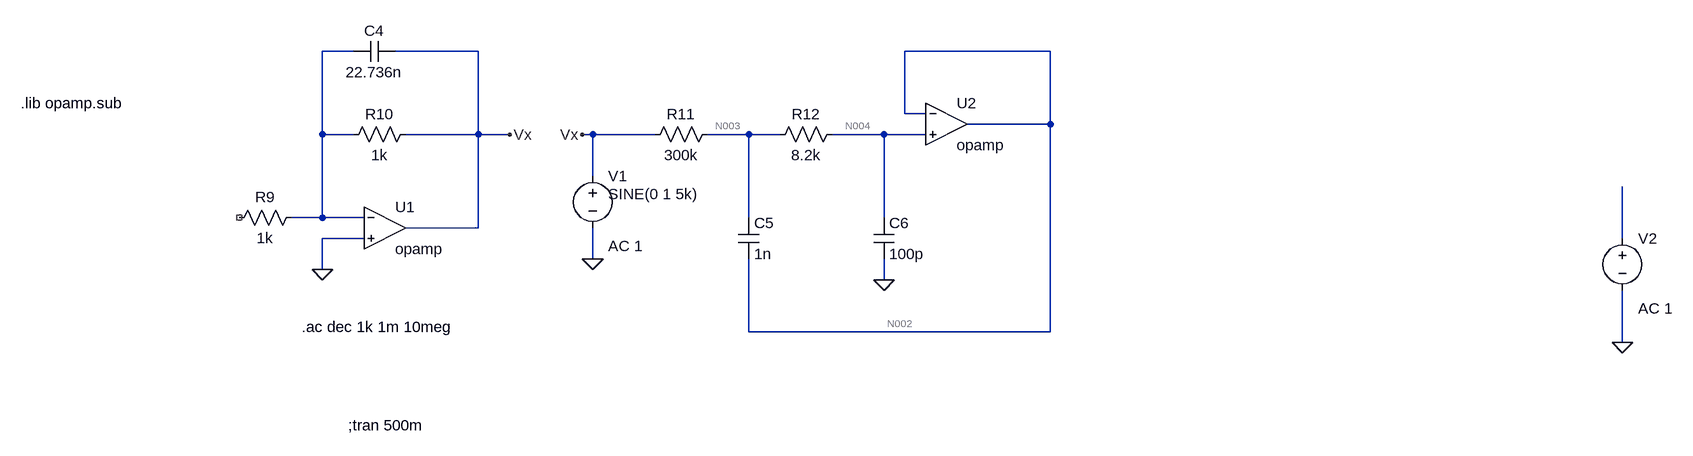
[diagram p0: schematic fig10.asc]
fig10.asc, the LTspice schematic file:
Version 4
SHEET 1 2240 680
WIRE 208 -160 160 -160
WIRE 400 -160 272 -160
WIRE 1280 -160 1056 -160
WIRE 1056 -64 1056 -160
WIRE 1088 -64 1056 -64
WIRE 1280 -48 1280 -160
WIRE 1280 -48 1152 -48
WIRE 160 -32 160 -160
WIRE 208 -32 160 -32
WIRE 400 -32 400 -160
WIRE 400 -32 288 -32
WIRE 448 -32 400 -32
WIRE 576 -32 560 -32
WIRE 672 -32 576 -32
WIRE 816 -32 752 -32
WIRE 864 -32 816 -32
WIRE 1024 -32 944 -32
WIRE 1088 -32 1024 -32
WIRE 576 32 576 -32
WIRE 160 96 160 -32
WIRE 160 96 112 96
WIRE 224 96 160 96
WIRE 816 96 816 -32
WIRE 1024 96 1024 -32
WIRE 400 112 400 -32
WIRE 400 112 288 112
WIRE 224 128 160 128
WIRE 2160 128 2160 48
WIRE 576 160 576 112
WIRE 160 176 160 128
WIRE 1024 192 1024 160
WIRE 816 272 816 160
WIRE 1280 272 1280 -48
WIRE 1280 272 816 272
WIRE 2160 288 2160 208
FLAG 160 176 0
FLAG 576 160 0
FLAG 1024 192 0
FLAG 2160 288 0
FLAG 448 -32 Vx
FLAG 560 -32 Vx
SYMBOL Opamps\\opamp 256 48 R0
SYMATTR InstName U1
SYMBOL res 128 80 R90
WINDOW 0 0 56 VBottom 2
WINDOW 3 32 56 VTop 2
SYMATTR InstName R9
SYMATTR Value 1k
SYMBOL res 304 -48 R90
WINDOW 0 0 56 VBottom 2
WINDOW 3 32 56 VTop 2
SYMATTR InstName R10
SYMATTR Value 1k
SYMBOL cap 272 -176 R90
WINDOW 0 0 32 VBottom 2
WINDOW 3 32 32 VTop 2
SYMATTR InstName C4
SYMATTR Value 22.736n
SYMBOL voltage 576 16 R0
WINDOW 123 24 124 Left 2
WINDOW 39 0 0 Left 0
WINDOW 3 24 44 Left 2
SYMATTR Value2 AC 1
SYMATTR InstName V1
SYMATTR Value SINE(0 1 5k)
SYMBOL res 768 -48 R90
WINDOW 0 0 56 VBottom 2
WINDOW 3 32 56 VTop 2
SYMATTR InstName R11
SYMATTR Value 300k
SYMBOL res 960 -48 R90
WINDOW 0 0 56 VBottom 2
WINDOW 3 32 56 VTop 2
SYMATTR InstName R12
SYMATTR Value 8.2k
SYMBOL cap 800 96 R0
SYMATTR InstName C5
SYMATTR Value 1n
SYMBOL Opamps\\opamp 1120 -112 R0
SYMATTR InstName U2
SYMBOL cap 1008 96 R0
SYMATTR InstName C6
SYMATTR Value 100p
SYMBOL voltage 2160 112 R0
WINDOW 123 24 124 Left 2
WINDOW 39 0 0 Left 0
SYMATTR Value2 AC 1
SYMATTR InstName V2
SYMATTR Value ""
TEXT 128 264 Left 2 !.ac dec 1k 1m 10meg
TEXT -304 -80 Left 2 !.lib opamp.sub
TEXT 200 416 Left 2 !;tran 500m

The netlist it stands for:
* fig10.asc
XU1 N001 0 Vx opamp Aol=100K GBW=10Meg  ; pins invin noninvin out
R9 N001 NC_01 1k
R10 Vx N001 1k
C4 Vx N001 22.736n
V1 Vx 0 SINE(0 1 5k) AC 1
R11 N003 Vx 300k
R12 N004 N003 8.2k
C5 N003 N002 1n
XU2 N002 N004 N002 opamp Aol=100K GBW=10Meg  ; pins invin noninvin out
C6 N004 0 100p
V2 N005 0 AC 1
.ac dec 1k 1m 10meg
.lib opamp.sub
;tran 500m
.backanno
.end

* Results of the author's LTspice run, read from the files saved beside the schematic
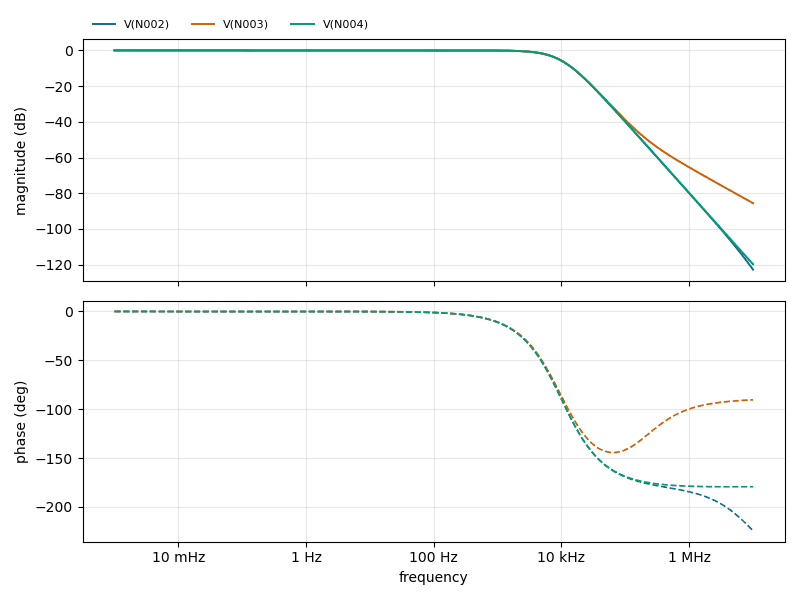
[diagram p1: AC Analysis of fig10.asc, plotted from the saved traces]
* AC Analysis, 1 run:
*   V(N002): -0.00 dB at 1 mHz, -122.84 dB at 10 MHz, peak -0.00 dB at 3.981 mHz, 3 dB below the peak at 6.721 kHz
*   V(N003): -0.00 dB at 1 mHz, -85.59 dB at 10 MHz, peak 0.00 dB at 3.981 mHz, 3 dB below the peak at 6.728 kHz
*   V(N004): -0.00 dB at 1 mHz, -119.83 dB at 10 MHz, peak 0.00 dB at 3.981 mHz, 3 dB below the peak at 6.721 kHz